# Altium schematic sheet Communication.SchDoc
size 101 x 152 mm; SheetNumber: 5; SheetTotal: 5
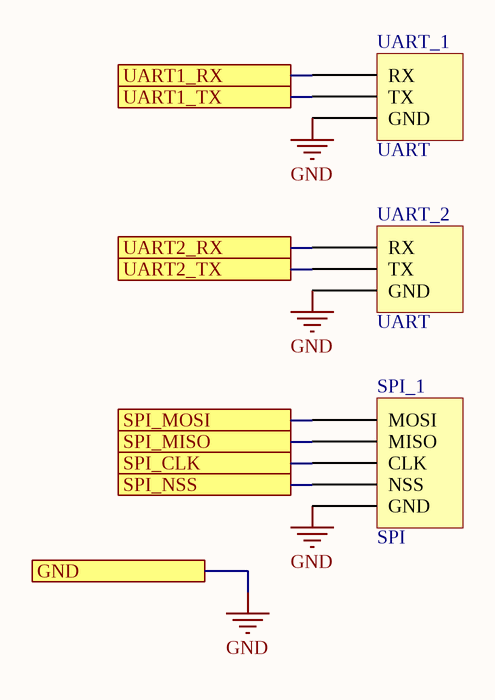
[diagram p0: Communication.SchDoc]

## Parts
SPI_1  SPI  [SPI]
UART_1  UART  [UART]
UART_2  UART  [UART]

## Ports
GND, SPI_CLK, SPI_MISO, SPI_MOSI, SPI_NSS, UART1_RX, UART1_TX, UART2_RX, UART2_TX

## Nets
GND: SPI_1.1(GND) UART_1.1(GND) UART_2.1(GND) ; port GND
SPI_CLK: SPI_1.4(CLK) ; port SPI_CLK
SPI_MISO: SPI_1.3(MISO) ; port SPI_MISO
SPI_MOSI: SPI_1.2(MOSI) ; port SPI_MOSI
SPI_NSS: SPI_1.5(NSS) ; port SPI_NSS
UART1_RX: UART_1.2(RX) ; port UART1_RX
UART1_TX: UART_1.3(TX) ; port UART1_TX
UART2_RX: UART_2.2(RX) ; port UART2_RX
UART2_TX: UART_2.3(TX) ; port UART2_TX